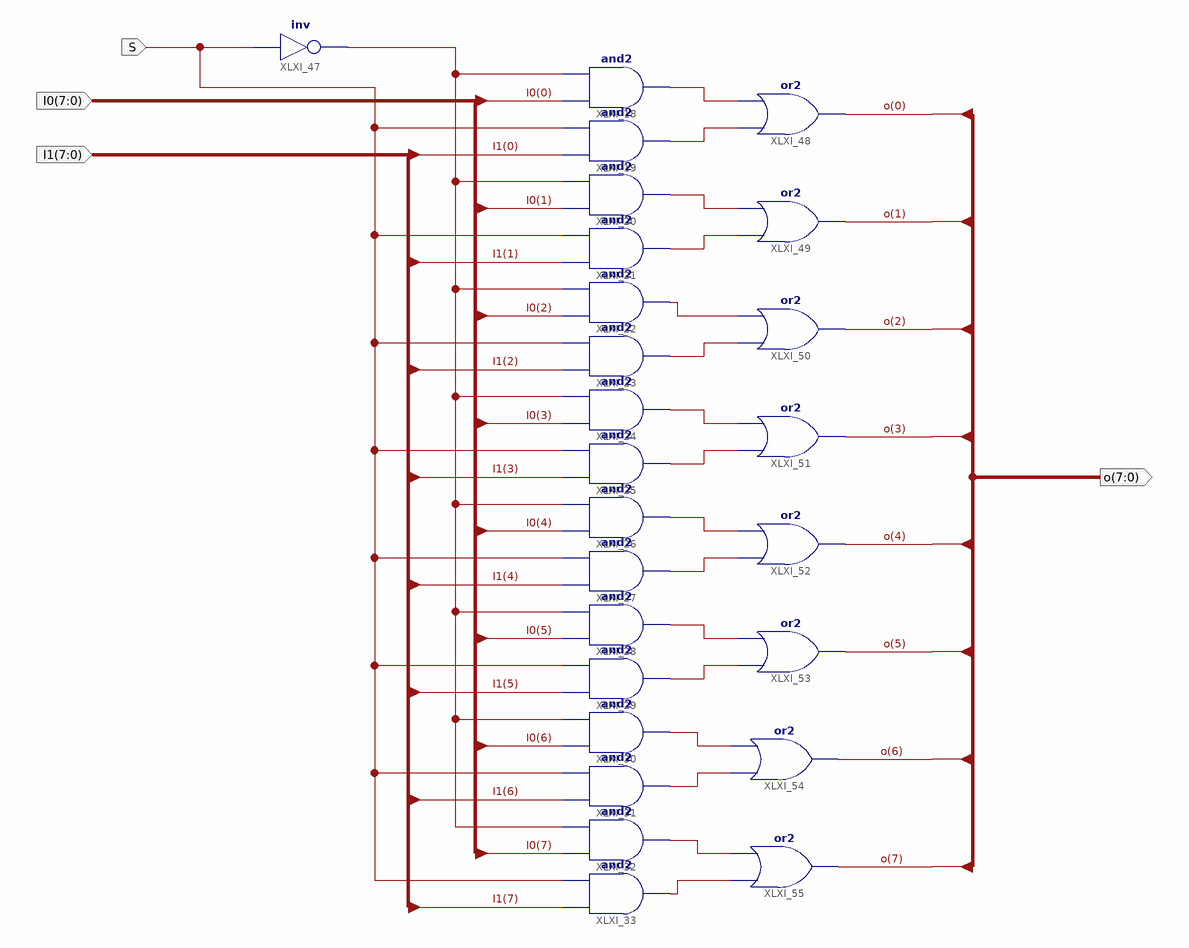
[diagram p0: schematic sheet 1]
// Xilinx ISE schematic MUX2T1_8.sch (kintex7) as structural Verilog: 25 symbols, 4 ports
module MUX2T1_8 (
  input  S,
  input  [7:0] I0,
  input  [7:0] I1,
  output [7:0] o
);

  wire XLXN_28, XLXN_36, XLXN_37, XLXN_38, XLXN_39, XLXN_41, XLXN_42, XLXN_43, XLXN_44, XLXN_45, XLXN_46,
       XLXN_47, XLXN_48, XLXN_49, XLXN_50, XLXN_51, XLXN_52;

  and XLXI_18 (XLXN_36, I0[0], XLXN_28);
  and XLXI_19 (XLXN_37, I1[0], S);
  and XLXI_20 (XLXN_38, I0[1], XLXN_28);
  and XLXI_21 (XLXN_39, I1[1], S);
  and XLXI_22 (XLXN_41, I0[2], XLXN_28);
  and XLXI_23 (XLXN_42, I1[2], S);
  and XLXI_24 (XLXN_43, I0[3], XLXN_28);
  and XLXI_25 (XLXN_44, I1[3], S);
  and XLXI_26 (XLXN_45, I0[4], XLXN_28);
  and XLXI_27 (XLXN_46, I1[4], S);
  and XLXI_28 (XLXN_47, I0[5], XLXN_28);
  and XLXI_29 (XLXN_48, I1[5], S);
  and XLXI_30 (XLXN_49, I0[6], XLXN_28);
  and XLXI_31 (XLXN_50, I1[6], S);
  and XLXI_32 (XLXN_51, I0[7], XLXN_28);
  and XLXI_33 (XLXN_52, I1[7], S);
  not XLXI_47 (XLXN_28, S);
  or XLXI_48 (o[0], XLXN_37, XLXN_36);
  or XLXI_49 (o[1], XLXN_39, XLXN_38);
  or XLXI_50 (o[2], XLXN_42, XLXN_41);
  or XLXI_51 (o[3], XLXN_44, XLXN_43);
  or XLXI_52 (o[4], XLXN_46, XLXN_45);
  or XLXI_53 (o[5], XLXN_48, XLXN_47);
  or XLXI_54 (o[6], XLXN_50, XLXN_49);
  or XLXI_55 (o[7], XLXN_52, XLXN_51);
endmodule
